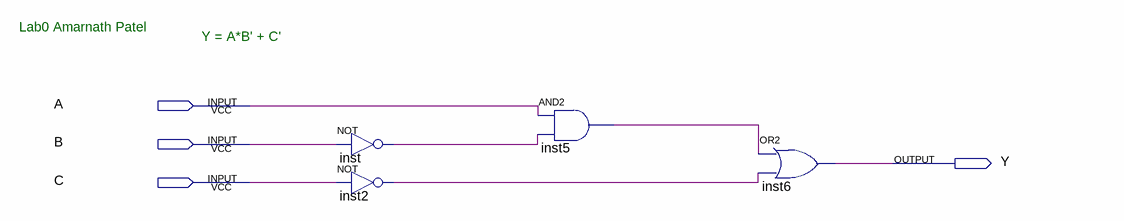
[diagram p0: schematic sheet]
// Quartus schematic Lab0_AmarnathPatel.bdf as structural Verilog: 4 symbols, 4 pins
module Lab0_AmarnathPatel (
  input  A,
  input  B,
  input  C,
  output Y
);

  wire inst2_out, inst5_out, inst_out;

  not inst (inst_out, B);
  not inst2 (inst2_out, C);
  and inst5 (inst5_out, A, inst_out);
  or inst6 (Y, inst5_out, inst2_out);

  // Notes on the sheet:
  //   Lab0 Amarnath Patel
  //   Y = A*B' + C'
endmodule
